# Altium schematic sheet 05_MOTORS.SchDoc: MOTORS
size A4; Author: Gabriel; Organization: Altium Limited; Address1: L3, 12a Rodborough Rd; Address2: Frenchs Forest; Address3: NSW; Address4: Australia 2086; SheetNumber: 5; SheetTotal: 5; Subtitle: XDRONE
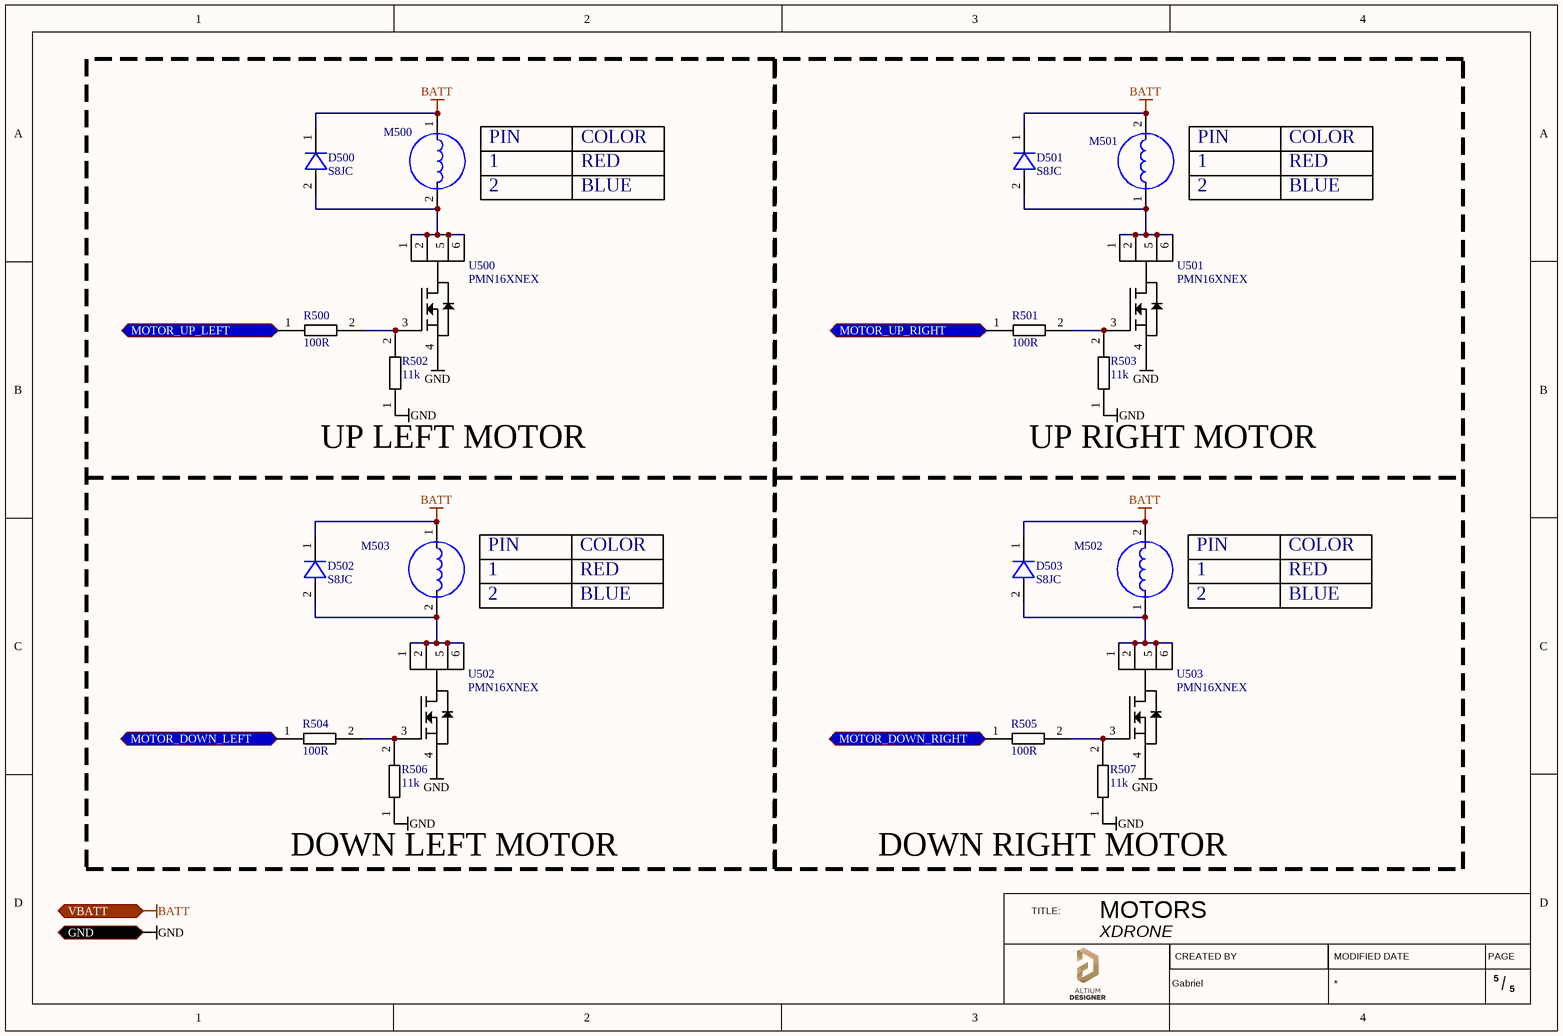
[diagram p0: 05_MOTORS.SchDoc]

## Parts
D500  MANUFACTURER REFERENCE: S8JC  (hidden comment: DIODE_600V_8A_1Vf_S8JC)
D501  MANUFACTURER REFERENCE: S8JC  (hidden comment: DIODE_600V_8A_1Vf_S8JC)
D502  MANUFACTURER REFERENCE: S8JC  (hidden comment: DIODE_600V_8A_1Vf_S8JC)
D503  MANUFACTURER REFERENCE: S8JC  (hidden comment: DIODE_600V_8A_1Vf_S8JC)
M500  BDC_1020_3.7V_4A  (value not drawn)
M501  BDC_1020_3.7V_4A  (value not drawn)
M502  BDC_1020_3.7V_4A  (value not drawn)
M503  BDC_1020_3.7V_4A  (value not drawn)
R500  value 100R  [RES_0402]  (hidden comment: RES_100R_1%_0402_RC0402FR-07100RL)
R501  value 100R  [RES_0402]  (hidden comment: RES_100R_1%_0402_RC0402FR-07100RL)
R502  value 11k  [RES_0402]  (hidden comment: RES_11k_5%_0402_ERJ-2GEJ113X)
R503  value 11k  [RES_0402]  (hidden comment: RES_11k_5%_0402_ERJ-2GEJ113X)
R504  value 100R  [RES_0402]  (hidden comment: RES_100R_1%_0402_RC0402FR-07100RL)
R505  value 100R  [RES_0402]  (hidden comment: RES_100R_1%_0402_RC0402FR-07100RL)
R506  value 11k  [RES_0402]  (hidden comment: RES_11k_5%_0402_ERJ-2GEJ113X)
R507  value 11k  [RES_0402]  (hidden comment: RES_11k_5%_0402_ERJ-2GEJ113X)
U500  MANUFACTURER REFERENCE: PMN16XNEX  (hidden comment: MOS_N_1G_20VDS_6.9A_0.65Vth_PMN16XNEX)
U501  MANUFACTURER REFERENCE: PMN16XNEX  (hidden comment: MOS_N_1G_20VDS_6.9A_0.65Vth_PMN16XNEX)
U502  MANUFACTURER REFERENCE: PMN16XNEX  (hidden comment: MOS_N_1G_20VDS_6.9A_0.65Vth_PMN16XNEX)
U503  MANUFACTURER REFERENCE: PMN16XNEX  (hidden comment: MOS_N_1G_20VDS_6.9A_0.65Vth_PMN16XNEX)

## Ports
GND (in), MOTOR_DOWN_LEFT (in), MOTOR_DOWN_RIGHT (in), MOTOR_UP_LEFT (in), MOTOR_UP_RIGHT (in), VBATT (in)

## Nets
BATT: D500.1 D501.1 D502.1 D503.1 M500.1 M501.2 M502.2 M503.1 ; port VBATT
GND: R502.1 R503.1 R506.1 R507.1 U500.4 U501.4 U502.4 U503.4 ; port GND
MOTOR_DOWN_LEFT: R504.1 ; port MOTOR_DOWN_LEFT
MOTOR_DOWN_RIGHT: R505.1 ; port MOTOR_DOWN_RIGHT
MOTOR_UP_LEFT: R500.1 ; port MOTOR_UP_LEFT
MOTOR_UP_RIGHT: R501.1 ; port MOTOR_UP_RIGHT
NetD500_2: D500.2 M500.2 U500.1 U500.2 U500.5 U500.6
NetD501_2: D501.2 M501.1 U501.1 U501.2 U501.5 U501.6
NetD502_2: D502.2 M503.2 U502.1 U502.2 U502.5 U502.6
NetD503_2: D503.2 M502.1 U503.1 U503.2 U503.5 U503.6
NetR500_2: R500.2 R502.2 U500.3
NetR501_2: R501.2 R503.2 U501.3
NetR504_2: R504.2 R506.2 U502.3
NetR505_2: R505.2 R507.2 U503.3

## Notes on the sheet
- (near M500) 1
- (near M500) PIN
- RED
- COLOR
- (near M501) 1
- (near M501) PIN
- 2
- BLUE
- (near R502) UP LEFT MOTOR
- (near R503) UP RIGHT MOTOR
- (near M503) 1
- (near M503) PIN
- (near M502) 1
- (near M502) PIN
- (near R506) DOWN LEFT MOTOR
- (near R507) DOWN RIGHT MOTOR
- TITLE:
- CREATED BY
- MODIFIED DATE
- PAGE
- /

## Library data of the parts
D500-D503 = DIODE_600V_8A_1Vf_S8JC: DIODE 600V 8A 1Vf S8JC; MANUFACTURER: TAIWAN; FORWARD VOLTAGE: 1V; TYPE: NORMAL; REVERSE VOLTAGE MAX: 600V; CURRENT MAX: 8A; PACKAGING: DO-214AB; MOUNTING: SMD
M500-M503 = BDC_1020_3.7V_4A: Brushed DC motor 3.7V; MANUFACTURER: Aliexpress; INPUT VOLTAGE MAX: 3.7; CURRENT MAX: 4A; PACKAGING: 1020; MOUNTING: THT
R500 R501 R504 R505 = RES_100R_1%_0402_RC0402FR-07100RL: RESISTOR 100R 1% 0402 RC0402FR-07100RL; MANUFACTURER: YAGEO; VOLTAGE RATING: 50V; TOLERANCE: 1%; MOUNTING: SMD; MANUFACTURER REFERENCE: RC0402FR-07100RL; PACKAGING: 0402
R502 R503 R506 R507 = RES_11k_5%_0402_ERJ-2GEJ113X: RESISTOR 11k 5% 0402 ERJ-2GEJ113X; MANUFACTURER: PANASONIC; VOLTAGE RATING: 50V; TOLERANCE: 5%; MOUNTING: SMD; MANUFACTURER REFERENCE: ERJ-2GEJ113X; PACKAGING: 0402
U500-U503 = MOS_N_1G_20VDS_6.9A_0.65Vth_PMN16XNEX: MOS N 1G 20VDS 6.9A 0.65Vth PMN16XNEX; MANUFACTURER: NEXPERIA; VOLTAGE DS MAX: 20V; NUMBER OF GATES: 1; VOLTAGE THRESHOLD: 0.65V; CURRENT MAX: 6.9A; PACKAGING: SOT-457; MOUNTING: SMD